# EAGLE design VL53L1X_Tiny (EAGLE 9.6.0)
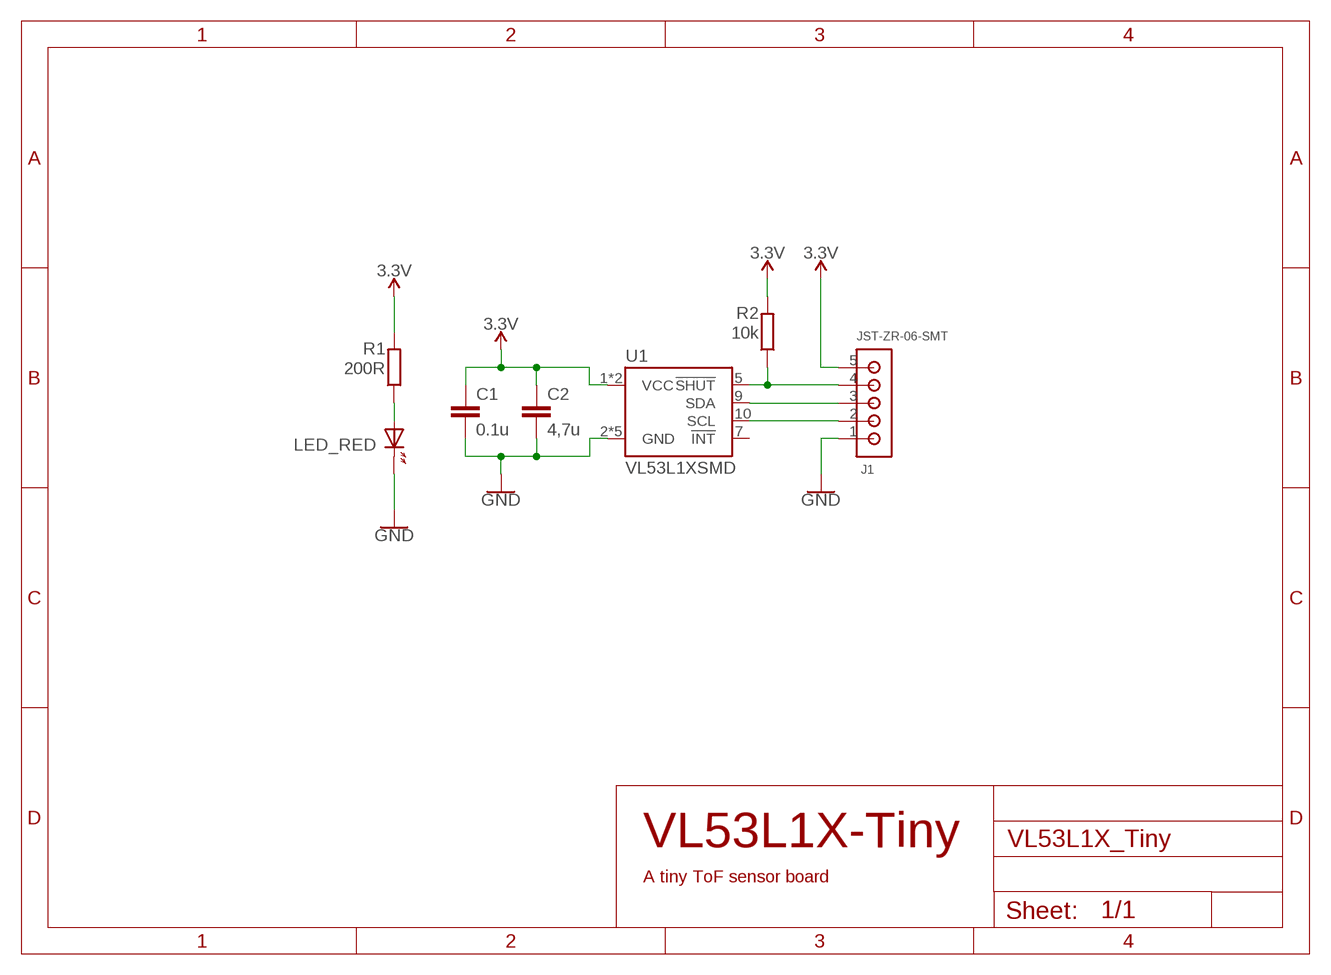
[diagram p0: schematic, sheet 1]

## Parts
C1  0.1u  C0603  [C0603]
C2  4,7u  C0603  [C0603]
J1  JST-ZR-06-SMT  JST_B5B-ZR-SM4-TF_LF_SNJST_B5B-ZR-SM4-TF_LF_SN_0_0  [JST_B5B-ZR-SM4-TF_LF_SN_0]
LED_RED  CHIP-LED0603  [CHIP-LED0603]
R1  200R  R0603  [R0603]
R2  10k  R0603  [R0603]
U1  VL53L1XSMD  [VL53L1X]

## Nets
3.3V: C1.1 C2.1 J1.5 R1.2 R2.2 U1.1(VCC) U1.11(VCC)
!SHUT: J1.4 R2.1 U1.5(!SHUT)
GND: C1.2 C2.2 J1.1 LED_RED.C(K) U1.2(GND) U1.3(GND) U1.4(GND) U1.6(GND) U1.12(GND)
N$4: LED_RED.A R1.1
SCL: J1.2 U1.10(SCL)
SDA: J1.3 U1.9(SDA)
Unconnected: U1.7(!INT)

## Notes on the sheet
- VL53L1X-Tiny
- A tiny ToF sensor board

## Library data of the parts
C1 C2 = CASE-RCL:C0603: Standard Chip CAPACITOR 0605 (1608 Metric) Description: Standard Chip CAPACITOR 0605 (1608 Metric)
J1 = Isaks Bibliotek:JST_B5B-ZR-SM4-TF_LF_SN: CONN HEADER ZH TOP 5POS 1.5MM; AUTOMOTIVE: No; CENTROID_NOT_SPECIFIED: No; CONN_GENDER: Male; CONN_ORIENTATION: Straight; CONTACT_MATERIAL: Tin; CURRENT_RATING: 1A; DATASHEET: http://www.jst-mfg.com/product/pdf/eng/eZH.pdf; DEVICE_CLASS_L1: Connectors; DEVICE_CLASS_L2: Board to Board Connectors; DEVICE_CLASS_L3: unset; DIGIKEY_DESCRIPTION: CONN HEADER SMD 5POS 1.5MM; DIGIKEY_PART_NUMBER: 455-1684-1-ND; FOOTPRINT_VARIANT_NAME_0: Recommended_Land_Pattern; HEIGHT: 5mm; LEAD_FREE: Yes; MF: JST; MFG_PACKAGE_IDENT: B5B-ZR-SM4-TF(LF)(SN); MFG_PACKAGE_IDENT_DATE: 0; MFG_PACKAGE_IDENT_REV: 0; MPN: B5B-ZR-SM4-TF(LF)(SN); NUMBER_OF_CONTACTS: 5; NUMBER_OF_ROWS: 1; PACKAGE: HDR5; PITCH: 1.5mm; PREFIX: J; ROHS: Yes; TEMPERATURE_RANGE_HIGH: +85°C; TEMPERATURE_RANGE_LOW: -25°C; VERIFICATION_VERSION: 0.0.0.2; VOLTAGE_RATING: 50V
LED_RED = CASE-LED:CHIP-LED0603: CHIP-LED0603 (SMD) Description: Standard 0603 SMD CHIP-LED
R1 R2 = CASE-RCL:R0603: Standard Chip RESISTOR 0603 (1608 Metric) Description: Standard Chip RESISTOR 0603 (1608 Metric)
U1 = Sensors:VL53L1X: STMicroelectronics VL53L1X - 400 cm IR Laser ToF Sensor VL53L1X is a state-of-the-art ToF laser-ranging sensor, enhancing the ST FlightSense product family. It is the fastest miniature ToF sensor currently on the market with accurate ranging up to 4 m and fast ranging frequency (up to 50 Hz). Housed in a miniature and reflowable package, it integrates a single photon avalanche diode (SPAD) receiving array, a 940 nm invisible laser Class 1 emitter, physical infrared filters, and optics to achieve the best ranging performance in various ambient lighting conditions with a range of cover window options.; PROD_ID: IC-13960

## Board
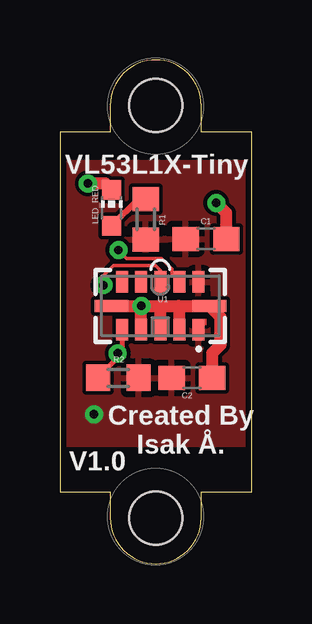
[diagram p1: board, top side]
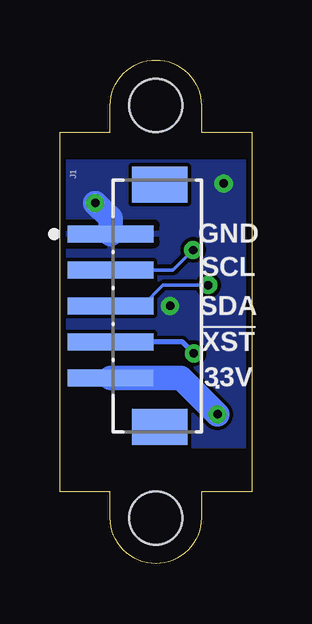
[diagram p2: board, bottom side, seen from below]

Size 8 x 21 mm. Coordinates in mm from the lower left corner, seen from the top.
Outline: 2.1,1.9 arc180 5.9,1.9 5.9,3 8,3 8,18 5.9,18 5.9,19.1 arc180 2.1,19.1 2.1,18 0,18 0,3 2.1,3 2.1,1.9
Copper layers (1*16): Top 0.035mm / dielectric 1.5mm / Bottom 0.035mm
Design rules "default *": minimum track width 6mil, minimum drill 0.35mm, track to track 6mil, track to pad 6mil, pad to pad 6mil, via to via 6mil, smd to smd 6mil, copper to edge 10mil, drill to drill 6mil, minimum pad ring 10mil, minimum via ring 8mil, stop-mask expansion 4mil, vias tented up to drill 0mil, thermal gap 10mil
Holes 2.2 mm at 4,19.1 4,1.9

### Footprints (pad centres in the part's own frame; a part is rotated, then mirrored left to right if it is on the bottom)
C0603 = smd 1.1 x 1: 1 -0.85,0; 2 0.85,0
JST_B5B-ZR-SM4-TF_LF_SN_0 = smd 0.7 x 3.6: 1 -3,-1.95; 2 -1.5,-1.95; 3 0,-1.95; 4 1.5,-1.95; 5 3,-1.95 | smd 1.5 x 2.3: 6 -5.05,0.1; 7 5.05,0.1
CHIP-LED0603 = smd 0.8 x 0.8: A 0,-0.75; C 0,0.75
R0603 = smd 1 x 1.1: 1 -0.85,0; 2 0.85,0
VL53L1X = smd 0.5 x 0.9: 1 1.6,-1; 2 0.8,-1; 3 0,-1; 4 -0.8,-1; 5 -1.6,-1; 7 -1.6,1; 8 -0.8,1; 9 0,1; 10 0.8,1; 11 1.6,1 | smd 1.4 x 0.5: 6 -2.05,0; 12 2.05,0

### Placement (x,y rotation side)
C1  6.1,13.54 0 top
C2  5.51,7.75 0 top
J1  3.94,10.74 270 bottom
LED_RED  2.16,14.83 0 top
R1  3.58,14.35 270 top
R2  2.44,7.75 0 top
U1  4.19,10.74 0 top

### Tracks (layer width: path | path; a pad name or v marks a point on that pad's centre or on a via)
3.3V  (via drill 0.35)
  Bottom 1.016: J1.5 2.94,7.74 v1.42,6.22
  pour Top: -1.27,16.76 9.02,16.76 9.02,4.93 -1.27,4.93
!SHUT  (via drill 0.35)
  Top 0.203: U1.5 2.59,8.94 v2.41,8.76 2.41,8.57 R2.1
  Bottom 0.203: v2.41,8.76 2.89,9.24 J1.4
GND  (via drill 0.35)
  Top 0.508: U1.6 v3.4,10.74 | v3.4,10.74 4.19,10.74 | 4.19,10.74 4.95,10.74 | 4.95,10.74 U1.12 6.71,10.28 6.71,9.12 6.36,8.78 C2.2 | 3.4,9.76 U1.4 v3.39,10.73 v3.4,10.74 | U1.3 4.19,10.74 | 4.19,10.74 | U1.2 4.99,10.71 4.95,10.74 | LED_RED.C 1.89,15.85 v1.17,15.85 | C1.2 6.95,14.62 v6.53,15.04
  Bottom 1.016: J1.1 5.89,14.4 v6.53,15.04
  pour Bottom: -2.24,16.79 10.64,16.79 10.64,4.88 -2.24,4.88
N$4
  Top 0.254: LED_RED.A 3.28,15.2 R1.1
SCL  (via drill 0.35)
  Top 0.152: U1.10 4.67,12.07 4.67,12.29 4.23,12.73 2.79,12.73 v2.45,13.07
  Bottom 0.152: v2.45,13.07 3.27,12.24 J1.2
SDA  (via drill 0.35)
  Top 0.152: v1.81,11.61 1.81,11.99 2.25,12.42 3.98,12.42 4.19,12.22 U1.9
  Bottom 0.152: v1.81,11.61 3.69,11.61 4.55,10.74 J1.3

### Text on the board
tPlace: VL53L1X-Tiny | Created By / Isak Å. | V1.0
bPlace: GND | SCL | SDA | !XST | 33V | .